# Altium schematic sheet USBSchem.SchDoc
size A; SheetNumber: 1; SheetTotal: 1
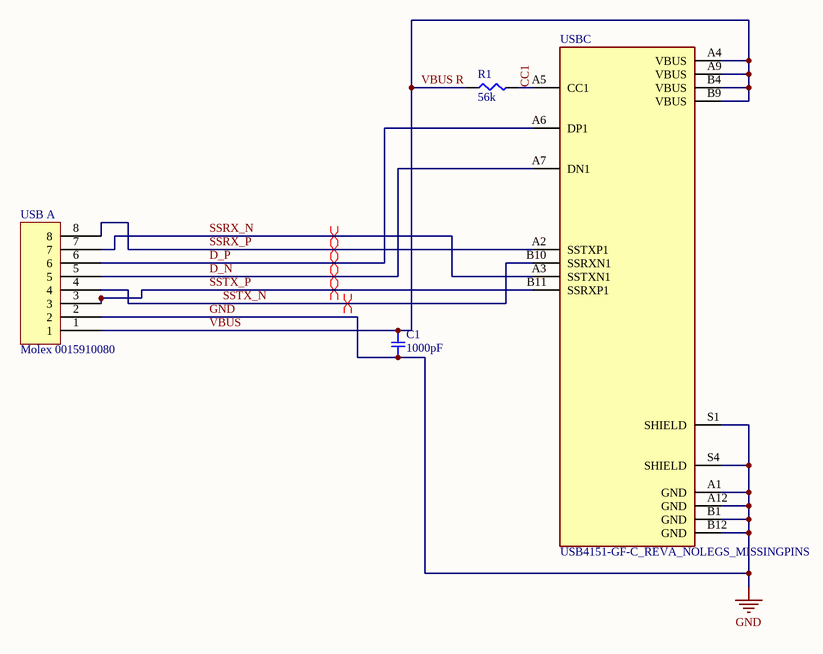
[diagram p0: USBSchem.SchDoc]

## Parts
C1  1000pF  [SMD-0603C]
R1  56k  [SMD-0805-RES]
USB_A  Molex 0015910080  [Molex 0015910080]
USBC  USB4151-GF-C_REVA_NOLEGS_MISSINGPINS  [GCT_USB4151-GF-C_REVA_NOLEGS_MISSINGPINS]

## Nets
GND: C1.2 USB_A.2 USBC.A1(GND) USBC.A12(GND) USBC.B1(GND) USBC.B12(GND) USBC.S1(SHIELD) USBC.S4(SHIELD)
CC1: R1.2 USBC.A5(CC1)
D_N: USB_A.5 USBC.A7(DN1)
D_P: USB_A.6 USBC.A6(DP1)
SSRX_N: USB_A.7 USBC.A3(SSTXN1)
SSRX_P: USB_A.8 USBC.A2(SSTXP1)
SSTX_N: USB_A.4 USBC.B10(SSRXN1)
SSTX_P: USB_A.3 USBC.B11(SSRXP1)
VBUS: C1.1 R1.1 USB_A.1 USBC.A4(VBUS) USBC.A9(VBUS) USBC.B4(VBUS) USBC.B9(VBUS)  [also labelled VBUS R]

## Layout directives
differential pair: D_N, D_P, SSRX_N, SSRX_P, SSTX_N, SSTX_P

## Library data of the parts
C1 = GRM188R71C102KA01D: Capacitor used for bypass between GND and VBUS; Manufacturer: Murata Electronics North America; Unit Price (USD): 0.1; Tolerance: ±10%; Total Quantity: 2; Total Price (USD): 0.2; Datasheets: http://www.murata.com/~/media/webrenewal/support/library/catalog/products/capacitor/mlcc/c02e.pdf; Digi-Key Part Number: 490-11509-1-ND; Quantity Available: 39666; Value: 1000pF; Operating Temperature: -55°C ~ 125°C; Size / Dimension: 0.063" L x 0.031" W (1.60mm x 0.80mm); Manufacturer Part Number: GRM188R71C102KA01D
R1 = ERJ-6GEYJ563V: Connects pin A5 on USBC to VBUS; Manufacturer: Panasonic Electronic Components; Unit Price (USD): 0.00496; Tolerance: ±5%; Total Quantity: 2; Total Price (USD): 0.00992; Datasheets: http://industrial.panasonic.com/www-cgi/jvcr13pz.cgi?E+PZ+3+AOA0001+ERJ6GEYJ563V+7+WW; Digi-Key Part Number: P56KACT-ND; Quantity Available: 43472; Value: 56k; Operating Temperature: -55°C ~ 155°C; Size / Dimension: 0.079" L x 0.049" W (2.00mm x 1.25mm); Manufacturer Part Number: ERJ-6GEYJ563V
USB_A = Molex 0015910080: USB A header; Total Quantity: 2; Total Price (USD): 2.44; Unit Price (USD): 1.22; Manufacturer: Molex; Manufacturer Part Number: 0015910080; Datasheets: https://www.molex.com/pdm_docs/sd/015910080_sd.pdf; Digi-Key Part Number: WM17458-ND; Quantity Available: 20779
USBC = USB4151-GF-C_REVA_NOLEGS_MISSINGPINS: USB Type C 3.1 vertical surface mount connector; MF: Global Connector Technology; Package: None; Availability: Unavailable; SnapEDA_Link: https://www.snapeda.com/parts/USB4151-GF-C/Global%20Connector%20Technology/view-part/4594022/?ref=snap; MP: USB4151-GF-C; Value: *; Price: None